# EAGLE design ginabt (EAGLE 6.2)
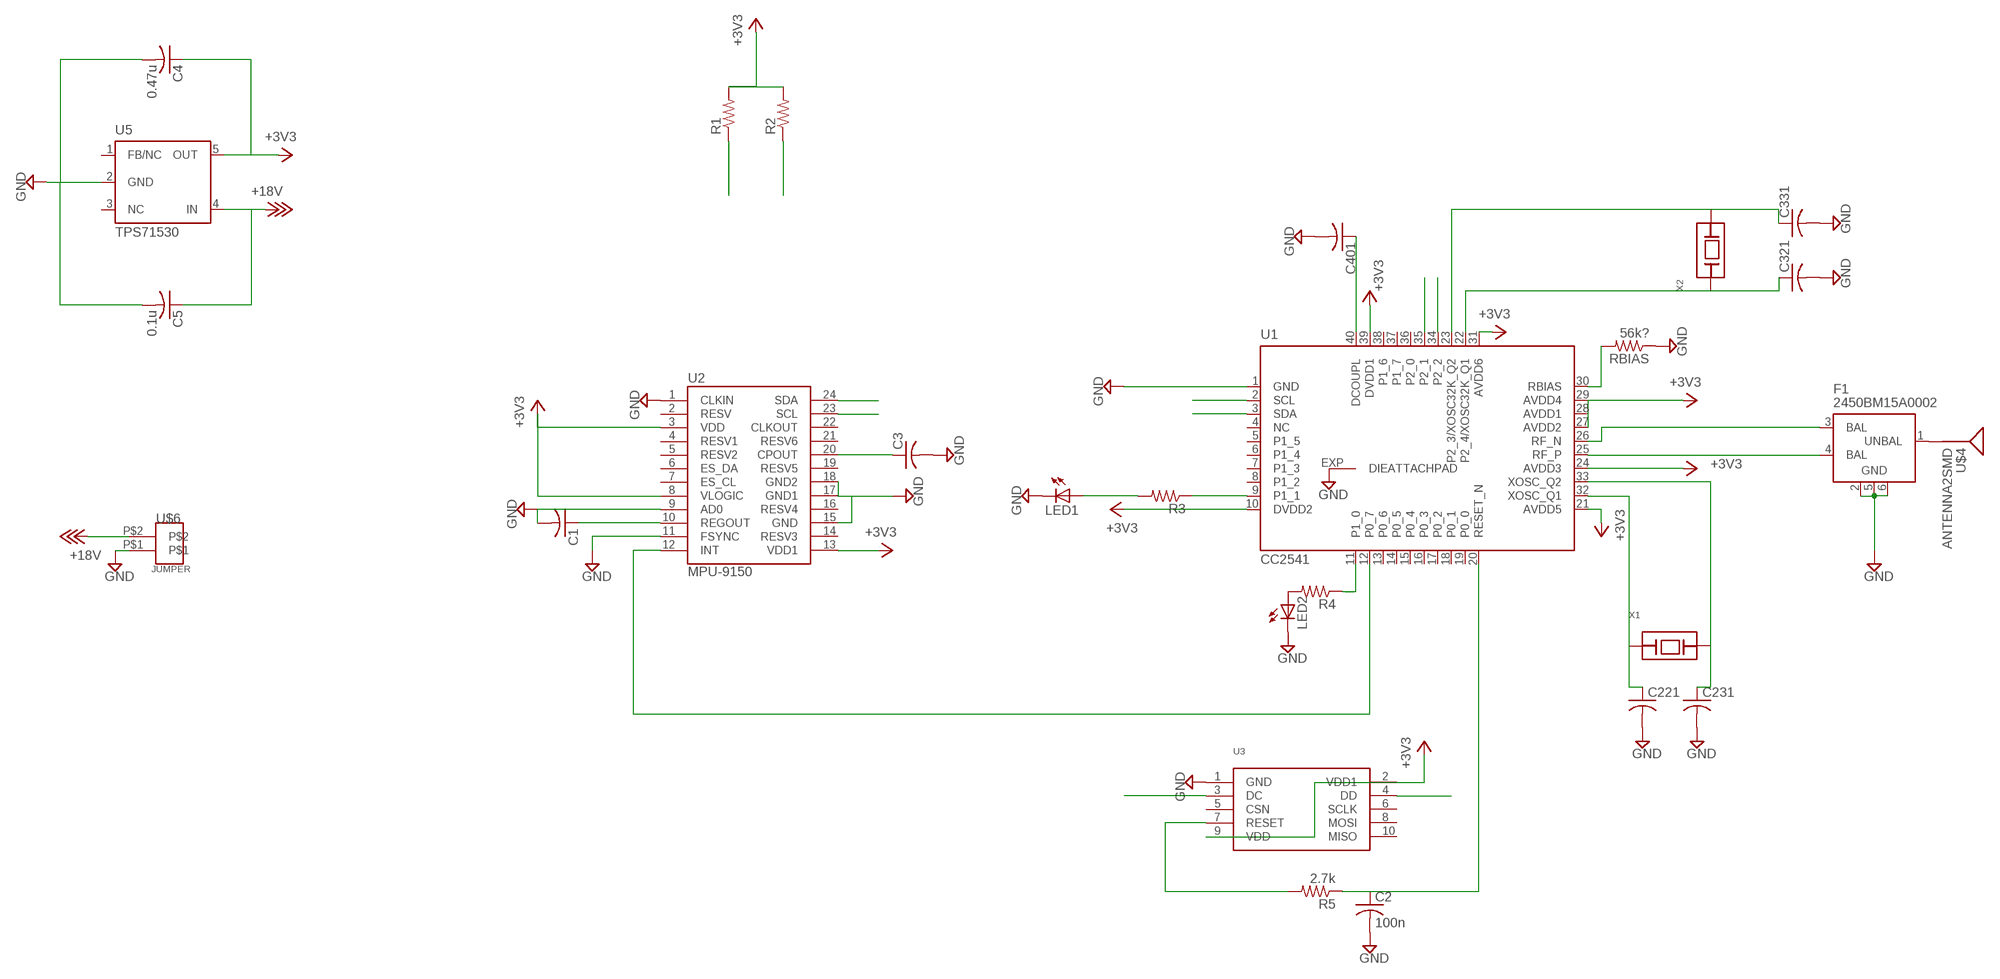
[diagram p0: schematic, sheet 1]

## Parts
C1  C-USC0402K  [C0402K]
C2  100n  C-USC0402K  [C0402K]
C3  C-USC0402K  [C0402K]
C4  0.47u  C-USC0402K  [C0402K]
C5  0.1u  C-USC0402K  [C0402K]
C221  C-USC0402K  [C0402K]
C231  C-USC0402K  [C0402K]
C321  C-USC0402K  [C0402K]
C331  C-USC0402K  [C0402K]
C401  C-USC0402K  [C0402K]
F1  2450BM15A0002  [2450BM15A0002]
LED1  LED  [SMARTLED-TTW]
LED2  LED  [SMARTLED-TTW]
R1  R-US_R0402  [R0402]
R2  R-US_R0402  [R0402]
R3  R-US_R0402  [R0402]
R4  R-US_R0402  [R0402]
R5  2.7k  R-US_R0402  [R0402]
RBIAS  56k?  R-US_R0402  [R0402]
U1  CC2541  [RHA_S-PVQFN-N40]
U2  MPU-9150  [LGA-24]
U3  CCDEBUGGER  [SMD-050-HEADER-2X5]
U5  TPS71530  [DCK_R-PDSO-G5]
U$4  ANTENNA2SMD  [ANTENNA-CHIP2]
U$6  JUMPER  [JUMPER_1X2_80MIL]
X1  XTALABS07  [ABS07]
X2  XTALCX3225SA  [CX3225SA]

## Nets
+3V3: C4.1 R1.2 R2.2 U1.10(DVDD2) U1.21(AVDD5) U1.24(AVDD3) U1.27(AVDD2) U1.28(AVDD1) U1.29(AVDD4) U1.31(AVDD6) U1.39(DVDD1) U2.3(VDD) U2.8(VLOGIC) U2.13(VDD1) U3.2(VDD1) U3.9(VDD) U5.5(OUT)
+18V: C5.1 U5.4(IN) U$6.P$2
DC: U1.34(P2_2) U3.3(DC)
DD: U1.35(P2_1) U3.4(DD)
GND: C1.2 C2.2 C3.2 C4.2 C5.2 C221.2 C231.2 C321.2 C331.2 C401.2 F1.2(GND) F1.5(GND) F1.6(GND) LED1.C@1(C) LED2.C@1(C) RBIAS.1 U1.1(GND) U1.EXP(DIEATTACHPAD) U2.1(CLKIN) U2.9(AD0) U2.11(FSYNC) U2.15(GND) U2.17(GND1) U2.18(GND2) U3.1(GND) U5.2(GND) U$6.P$1
N$1: C401.1 U1.40(DCOUPL)
N$2: LED2.A@1(A) R4.2
N$3: R4.1 U1.11(P1_0)
N$4: C221.1 U1.32(XOSC_Q1) X1.1(A)
N$5: C231.1 U1.33(XOSC_Q2) X1.2(B)
N$6: C321.1 U1.22(P2_4/XOSC32K_Q1) X2.3(A)
N$7: C331.1 U1.23(P2_3/XOSC32K_Q2) X2.1(B)
N$8: F1.3(BAL) U1.26(RF_N)
N$9: F1.4(BAL) U1.25(RF_P)
N$10: C1.1 U2.10(REGOUT)
N$11: F1.1(UNBAL) U$4.FEED(SIGNAL)
N$12: U1.12(P0_7) U2.12(INT)
N$13: R3.1 U1.9(P1_1)
N$14: C3.1 U2.20(CPOUT)
N$15: LED1.A@1(A) R3.2
N$16: RBIAS.2 U1.30(RBIAS)
N$19: R5.2 U3.7(RESET)
N$20: C2.1 R5.1 U1.20(RESET_N)
SCL: R1.1 U1.2(SCL) U2.23(SCL)
SDA: R2.1 U1.3(SDA) U2.24(SDA)
Unconnected: U1.4(NC) U1.5(P1_5) U1.6(P1_4) U1.7(P1_3) U1.8(P1_2) U1.13(P0_6) U1.14(P0_5) U1.15(P0_4) U1.16(P0_3) U1.17(P0_2) U1.18(P0_1) U1.19(P0_0) U1.36(P2_0) U1.37(P1_7) U1.38(P1_6) U2.2(RESV) U2.4(RESV1) U2.5(RESV2) U2.6(ES_DA) U2.7(ES_CL) U2.14(RESV3) U2.16(RESV4) U2.19(RESV5) U2.21(RESV6) U2.22(CLKOUT) U3.5(CSN) U3.6(SCLK) U3.8(MOSI) U3.10(MISO) U5.1(FB/NC)

## Power pins joined to a net without a drawn wire
NC: U5.3(NC)

## Library data of the parts
C1-C5 C221 C231 C321 C331 C401 = rcl:C-US: CAPACITOR, American symbol
F1 = johanson-technology:2450BM15A0002: 2.45 GHz Impedance Matched Balun-Filter For TI CC253X/CC2540 Chipset family Data sheet <http://www.johansontechnology.com/images/stories/ip/baluns/balun_filter_combo_matched_2450bm15a0002_v8.pdf>
LED1 LED2 = led:LED: LED OSRAM: - CHIPLED LG R971, LG N971, LY N971, LG Q971, LY Q971, LO R971, LY R971 LH N974, LH R974 LS Q976, LO Q976, LY Q976 LO Q996 - Hyper CHIPLED LW Q18S LB Q993, LB Q99A, LB R99A - SideLED LS A670, LO A670, LY A670, LG A670, LP A670 LB A673, LV A673, LT A673, LW A673 LH A674 LY A675 LS A676, LA A676, LO A676, LY A676, LW A676 LS A679, LY A679, LG A679 - Hyper Micro SIDELED® LS Y876, LA Y876, LO Y876, LY Y876 LT Y87S - SmartLED LW L88C, LW L88S LB L89C, LB L89S, LG L890 LS L89K, LO L89K, LY L89K LS L896, LA L896, LO L896, LY L896 - TOPLED LS T670, LO T670, LY T670, LG T670, LP T670 LSG T670, LSP T670, LSY T670, LOP T670, LYG T670 LG T671, LOG T671, LSG T671 LB T673, LV T673, LT T673, LW T673 LH T674 LS T676, LA T676, LO T676, LY T676, LB T676, LH T676, LSB T676, LW T676 LB T67C, LV T67C, LT T67C, LS T67K, LO T67K, LY T67K, LW E67C LS E67B, LA E67B, LO E67B, LY E67B, LB E67C, LV E67C, LT E67C LW T67C LS T679, LY T679, LG T679 LS T770, LO T770, LY T770, LG T770, LP T770 LB T773, LV T773, LT T773, LW T773 LH T774 LS E675, LA E675, LY E675, LS T675 LS T776, LA T776, LO T776, LY T776, LB T776 LHGB T686 LT T68C, LB T68C - Hyper Mini TOPLED® LB M676 - Mini TOPLED Santana® LG M470 LS M47K, LO M47K, LY M47K Source: http://www.osram.convergy.de LUXEON: - LUMILED® LXK2-PW12-R00, LXK2-PW12-S00, LXK2-PW14-U00, LXK2-PW14-V00 LXK2-PM12-R00, LXK2-PM12-S00, LXK2-PM14-U00 LXK2-PE12-Q00, LXK2-PE12-R00, LXK2-PE12-S00, LXK2-PE14-T00, LXK2-PE14-U00 LXK2-PB12-K00, LXK2-PB12-L00, LXK2-PB12-M00, LXK2-PB14-N00, LXK2-PB14-P00, LXK2-PB14-Q00 LXK2-PR12-L00, LXK2-PR12-M00, LXK2-PR14-Q00, LXK2-PR14-R00 LXK2-PD12-Q00, LXK2-PD12-R00, LXK2-PD12-S00 LXK2-PH12-R00, LXK2-PH12-S00 LXK2-PL12-P00, LXK2-PL12-Q00, LXK2-PL12-R00 Source: www.luxeon.com KINGBRIGHT: KA-3528ASYC Source: www.kingbright.com
R1-R5 RBIAS = rcl:R-US_: RESISTOR, American symbol
U1 = texas:CC2541
U2 = sparkfun:MPU-9150
U3 = texas:CCDEBUGGER
U5 = texas:TPS71530
U$4 = sparkfun:ANTENNA2: Antenna Single endded antenna. Common with smaller chip antennas. CHIP4 package is the GPS Chip Antenna SKU: GPS-08418. CHIP5 package is 2.4GHz chip antenna SKU: WRL-00144.
U$6 = daughter_solar_EAGLE_lbr:JUMPER
X1 X2 = wsnlib:XTAL: Crystals used in OpenMote

## Board
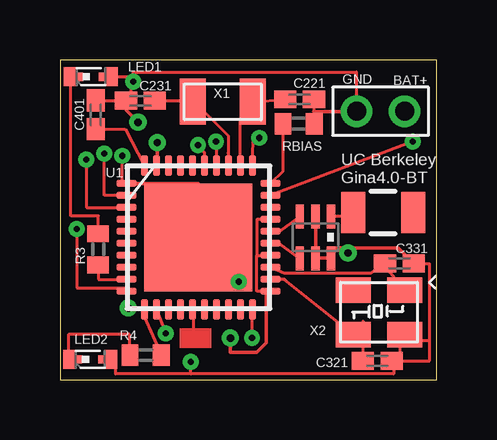
[diagram p1: board, top side]
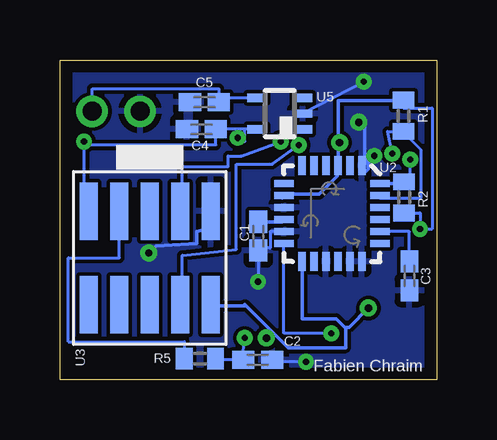
[diagram p2: board, bottom side, seen from below]

Size 15.7 x 13.35 mm. Coordinates in mm from the lower left corner, seen from the top.
Outline: 0,0 15.7,0 15.7,13.35 0,13.35 0,0
Copper layers (1*16): Top 0.035mm / dielectric 1.5mm / Bottom 0.035mm
Design rules "default": minimum track width 6mil, minimum drill 12mil, track to track 6mil, track to pad 6mil, pad to pad 6mil, via to via 6mil, smd to smd 8mil, copper to edge 20mil, drill to drill 8mil, minimum pad ring 10mil, minimum via ring 8mil, stop-mask expansion 4mil, vias tented up to drill 0mil, thermal gap 10mil

### Footprints (pad centres in the part's own frame; a part is rotated, then mirrored left to right if it is on the bottom)
C0402K = smd 0.925 x 0.74: 1 -0.6,0; 2 0.6,0
2450BM15A0002 = smd 0.35 x 1: 1 -0.65,-0.875; 2 0,-0.875; 3 0.65,-0.875; 4 0.65,0.875; 5 0,0.875; 6 -0.65,0.875
SMARTLED-TTW = smd 0.8 x 0.5: A 0,-0.875; C 0,0.875 | smd 0.35 x 0.35: A@1 0,-0.5; C@1 0,0.5
R0402 = smd 0.7 x 0.9: 1 -0.65,0; 2 0.65,0
RHA_S-PVQFN-N40 = smd 0.85 x 0.3: 1 -3,2.25; 2 -3,1.75; 3 -3,1.25; 4 -3,0.75; 5 -3,0.25; 6 -3,-0.25; 7 -3,-0.75; 8 -3,-1.25; 9 -3,-1.75; 10 -3,-2.25; 21 3,-2.25; 22 3,-1.75; 23 3,-1.25; 24 3,-0.75; 25 3,-0.25; 26 3,0.25; 27 3,0.75; 28 3,1.25; 29 3,1.75; 30 3,2.25 | smd 0.3 x 0.85: 11 -2.25,-3; 12 -1.75,-3; 13 -1.25,-3; 14 -0.75,-3; 15 -0.25,-3; 16 0.25,-3; 17 0.75,-3; 18 1.25,-3; 19 1.75,-3; 20 2.25,-3; 31 2.25,3; 32 1.75,3; 33 1.25,3; 34 0.75,3; 35 0.25,3; 36 -0.25,3; 37 -0.75,3; 38 -1.25,3; 39 -1.75,3; 40 -2.25,3 | smd 4.5 x 4.5: EXP 0,0
LGA-24 = smd 0.8 x 0.3: 1 -2,1.25; 2 -2,0.75; 3 -2,0.25; 4 -2,-0.25; 5 -2,-0.75; 6 -2,-1.25; 13 2,-1.25; 14 2,-0.75; 15 2,-0.25; 16 2,0.25; 17 2,0.75; 18 2,1.25 | smd 0.3 x 0.8: 7 -1.25,-2; 8 -0.75,-2; 9 -0.25,-2; 10 0.25,-2; 11 0.75,-2; 12 1.25,-2; 19 1.25,2; 20 0.75,2; 21 0.25,2; 22 -0.25,2; 23 -0.75,2; 24 -1.25,2
SMD-050-HEADER-2X5 = smd 0.76 x 2.4: 1 -2.54,-1.95; 2 -2.54,1.95; 3 -1.27,-1.95; 4 -1.27,1.95; 5 0,-1.95; 6 0,1.95; 7 1.27,-1.95; 8 1.27,1.95; 9 2.54,-1.95; 10 2.54,1.95
DCK_R-PDSO-G5 = smd 0.35 x 0.8: 1 -0.65,-0.95; 2 0,-0.95; 3 0.65,-0.95; 4 0.65,0.95; 5 -0.65,0.95
ANTENNA-CHIP2 = smd 1.7 x 1: FEED 0,1.25; P$2 0,-1.25
JUMPER_1X2_80MIL = drill 0.8: P$1 1,3; P$2 1,1
ABS07 = smd 1.1 x 1.9: 1 -1.25,0; 2 1.25,0
CX3225SA = smd 1.45 x 1.05: 1 -1.075,-0.925; 2 1.075,-0.925; 3 1.075,0.925; 4 -1.075,0.925

### Placement (x,y rotation side)
C1  7.44,6 270 bottom
C2  7.46,0.84 0 bottom
C3  1.14,4.34 270 bottom
C4  9.81,10.46 180 bottom
C5  9.68,11.59 180 bottom
C221  9.98,11.7 0 top
C231  3.35,11.65 180 top
C321  13.22,0.8 0 top
C331  14.14,4.86 0 top
C401  1.49,11.06 90 top
F1  10.64,5.95 180 top
LED1  1.29,12.65 270 top
LED2  1.26,0.86 270 top
R1  1.39,11.02 90 bottom
R2  1.36,7.62 270 bottom
R3  1.59,5.45 90 top
R4  3.57,1.04 180 top
R5  9.87,0.89 180 bottom
RBIAS  9.94,10.69 180 top
U1  5.77,5.95 0 top
U2  4.37,6.94 270 bottom
U3  11.96,5.09 180 bottom
U5  6.54,11.11 90 bottom
U$4  13.46,6.99 90 top
U$6  15.36,10.21 90 top
X1  6.78,11.61 180 top
X2  13.29,2.82 180 top

### Tracks (layer width: path | path; a pad name or v marks a point on that pad's centre or on a via)
+3V3  (via drill 0.25, 0.3)
  Top 0.127: v14.7,9.95 U1.29 U1.28 U1.27 8.2,6.7 8.2,5.2 | v0.7,6.3 0.7,3.85 2.77,3.85 U1.10 | U1.31 8.05,9.95 v8.3,10.1 | U1.21 8.2,3.7 8.2,5.2 | 8.2,5.2 U1.24
  Top 0.152: v4.05,9.9 4.05,8.95 U1.39 | v2.85,3 2.85,3.65 2.8,3.7 U1.10 | v7.1,1.75 7.1,1.15 8.2,1.15 8.6,1.55 8.6,3.55 8.75,3.7 U1.21
  Bottom 0.127: U5.5 8,10.46 | 8,10.46 C4.1 9.21,9.8 14.7,9.8 | U3.9 14.7,7.04 14.7,9.8 | 14.7,9.8 v14.7,9.95 | R2.2 0.7,6.97 v0.7,6.3 0.2,6.3 0.2,11.35 1.39,11.35 R1.2 | v8.3,10.1 8,9.95 8,10.46
  Bottom 0.152: 4.1,9.9 4.1,11.65 1.4,11.65 R1.2 | 4.1,9.9 4.1,8.95 U2.3 4.15,8.9 4.15,8.5 4.9,7.75 6.35,7.75 U2.8 6.4,7.65 6.45,7.6 | v4.05,9.9 4.1,9.9 | 3.8,2.15 4.2,2.55 5.6,2.55 5.6,4.9 U2.13 | 3.8,2.15 3.8,1.35 6.2,1.35 6.85,2 | 7.95,3.1 6.85,2 | 7.95,3.1 9.4,3.1 U3.2 | 8,3.15 7.95,3.1 | v2.85,3 3.65,2.2 3.75,2.2 3.8,2.15 | 6.85,2 v7.1,1.75
+18V
  Bottom 0.127: U5.4 8.58,11.76 C5.1 9.08,12.15 14.35,12.15 U$6.P$2
DC  (via drill 0.25)
  Top 0.127: v6.5,9.95 6.52,9.95 U1.34
  Bottom 0.127: U3.3 10.6,7.04 10.6,8.9 8.7,8.9 8.7,9.35 8.15,9.35 v6.5,9.95
DD  (via drill 0.25)
  Top 0.127: v5.75,9.8 6.02,9.5 U1.35
  Bottom 0.127: U3.4 10.6,3.14 10.6,5.2 8.35,5.45 8.35,9 6.85,9 v5.75,9.8
GND  (via drill 0.25, 0.3)
  Top 0.127: C401.2 C231.2 | C221.2 10.58,11.2 RBIAS.1 | 2.75,11.25 v3.05,12.45 | U1.1 2.6,8.2 v2.6,9.35 | 15.4,1.65 15.4,0.8 C321.2 13.9,0.8 13.9,0.25 5.45,0.25 | 15.4,1.65 15.4,4.85 C331.2 | v7.45,4.1 7.5,4.1 7.5,5.35 | v3.05,12.45 3.05,12.85 12.35,12.85 U$6.P$1 | 5.45,0.25 v5.45,0.75 | 14.8,1.65 15.4,1.65 | 5.45,0.25 2.31,0.25 2.31,0.86 LED2.C@1 | LED1.C@1 2.9,12.65 v3.05,12.45
  Top 0.152: U1.1 5.75,8.2 5.75,5.95 U1.EXP | C331.2 14.1,5.5 12,5.5 | 12,5.5 11.3,5.5 11.3,5.1 F1.6 11.25,5.1 10.65,5.1 F1.5 10.65,5.15 10.65,6.8 F1.2 | 10.58,11.2 U$6.P$1 | v3.25,10.75 2.75,11.25 C231.2 | v12,5.3 12,5.5
  Bottom 0.127: v3.05,12.45 3,12.45 U5.2 | v2.6,9.35 3,9.35 3,9.65 | v5.45,0.75 6.86,0.75 C2.2 | U2.11 6.95,6.19 6.95,5.5 7.39,5.5 C1.2 v7.45,4.1
  Bottom 0.152: v3.25,10.75 3,10.75 3,9.65 3,9.2 3.2,9.2 3.2,9.15 2.95,9.15 2.95,9.1 3.2,9.1 3.2,9.05 2.85,9.05 2.85,8.8 3,8.65 3.05,8.65 U2.1 | v12,5.3 11.7,5.6 10,5.7 10,6.2 9.45,6.35 9.45,7 U3.1 | C2.2 6.85,0.9 6.8,0.9 | U2.18 3.1,4.85 3.11,4.85 | U2.17 3.65,4.75 3.61,4.75
  pour Bottom: 0.05,13.25 0.05,0.35 15.45,0.35 15.45,5.9 11.45,5.9 11.45,8.1 15.45,8.1 15.45,13.25
N$1
  Top 0.127: C401.1 2.71,10.46 U1.40
N$2
  Top 0.127: R4.2 2.9,1.04 2.9,1.9 0.36,1.9 0.36,0.86 LED2.A@1
N$3
  Top 0.127: U1.11 3.52,2.64 R4.1
N$4
  Top 0.127: U1.32 7.52,10.75 X1.1 C221.1
N$5
  Top 0.127: C231.1 5.14,11.65 X1.2 5.94,11.26 7,10.2 7,9.47 U1.33
N$6
  Top 0.127: U1.22 9.35,4.2 X2.3 12.63,2.44 C321.1
N$7
  Top 0.127: X2.1 13.54,4.77 C331.1 12.93,4.45 9.35,4.45 U1.23
N$8
  Top 0.127: F1.3 9.14,6.2 U1.26
N$9
  Top 0.127: F1.4 9.14,5.7 U1.25
N$10
  Bottom 0.152: U2.10 6.4,6.65 6.45,6.6 7.3,6.6 7.35,6.55 C1.1
N$11
  Top 0.127: U$4.FEED 12.19,6.83 F1.1
N$12  (via drill 0.25)
  Top 0.127: U1.12 v4.4,1.95
  Bottom 0.127: v4.4,1.95 6.37,1.95 U2.12
N$13
  Top 0.127: R3.1 1.6,4.2 U1.9
N$14
  Bottom 0.127: C3.1 1.14,6.19 U2.20
N$15
  Top 0.127: R3.2 1.6,6.85 0.45,6.85 0.45,12.8 LED1.A@1
N$16
  Top 0.127: RBIAS.2 9.29,8.7 U1.30
N$17
  Top 0.127: 14.15,1.65 14.15,0.85
N$18
  Bottom 0.127: 1.1,11.7 1.05,11.7
N$19
  Bottom 0.127: U3.7 13.23,5.1 15.35,5.1 15.35,1.6 10.52,1.6 R5.2
N$20  (via drill 0.25)
  Top 0.127: v8,1.75 8.02,1.75 U1.20
  Bottom 0.127: v8,1.75 8.04,1.75 C2.1 9.22,0.84 R5.1
N$21
  Top 0.127: 5.55,2.55 5.55,2.15
SCL  (via drill 0.25)
  Top 0.127: U1.2 1.85,7.7 v1.85,9.45
  Bottom 0.127: U2.23 2.37,7.6 0.65,7.6 0.65,9.6 1.39,10.35 R1.1 2.05,10.37 v1.85,9.45
SDA  (via drill 0.25)
  Top 0.127: v1.1,9.2 1.1,7.2 U1.3
  Bottom 0.127: R2.1 1.36,8.19 U2.24 1.1,8.2 v1.1,9.2
(copper drawn outside any net)
  shapes: Top area x1

### Text on the board
tNames: GND | BAT+ | Gina4.0-BT | UC Berkeley
bNames: Fabien Chraim